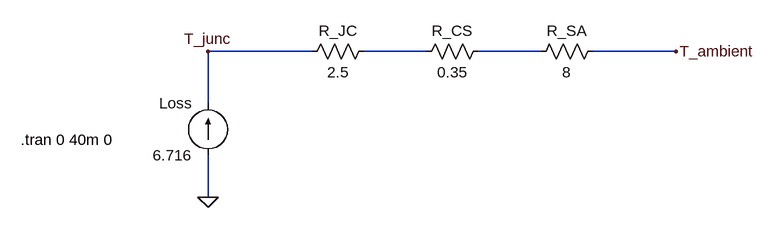
[diagram p0: schematic Thermal_Circuit.asc]
Thermal_Circuit.asc, the LTspice schematic file:
Version 4
SHEET 1 1436 1296
WIRE -960 -160 -1120 -160
WIRE -784 -160 -880 -160
WIRE -608 -160 -704 -160
WIRE -400 -160 -528 -160
WIRE -1120 -80 -1120 -160
WIRE -1120 64 -1120 0
FLAG -1120 64 0
FLAG -400 -160 T_ambient
FLAG -1120 -160 T_junc
SYMBOL res -864 -176 R90
WINDOW 0 0 56 VBottom 2
WINDOW 3 32 56 VTop 2
SYMATTR InstName R_JC
SYMATTR Value 2.5
SYMBOL res -688 -176 R90
WINDOW 0 0 56 VBottom 2
WINDOW 3 32 56 VTop 2
SYMATTR InstName R_CS
SYMATTR Value 0.35
SYMBOL res -512 -176 R90
WINDOW 0 0 56 VBottom 2
WINDOW 3 32 56 VTop 2
SYMATTR InstName R_SA
SYMATTR Value 8
SYMBOL current -1120 0 R180
WINDOW 0 24 80 Left 2
WINDOW 3 24 0 Left 2
SYMATTR InstName Loss
SYMATTR Value 6.716
TEXT -1408 -24 Left 2 !.tran 0 40m 0

The netlist it stands for:
* Thermal_Circuit.asc
R_JC N001 T_junc 2.5
R_CS N002 N001 0.35
R_SA T_ambient N002 8
I§Loss 0 T_junc 6.716
.tran 0 40m 0
.backanno
.end